# EAGLE design fatina (EAGLE 7.5.0)
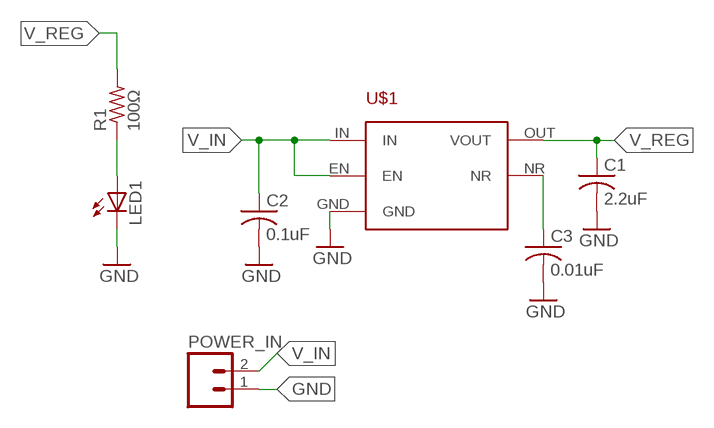
[diagram p0: schematic, sheet 1]

## Parts
C1  2.2uF  C-USC0603  [C0603]
C2  0.1uF  C-USC0603  [C0603]
C3  0.01uF  C-USC0603  [C0603]
LED1  LED5MM  [LED5MM]
POWER_IN  M02PTH  [1X02]
R1  100Ω  R-US_0204/7  [0204/7]
U$1  TPS799  [TPS799]

## Nets
GND: C1.2 C2.2 C3.2 LED1.K(C) POWER_IN.1 U$1.GND
N$1: LED1.A R1.1
N$2: C3.1 U$1.NR
V_IN: C2.1 POWER_IN.2 U$1.EN U$1.IN
V_REG: C1.1 R1.2 U$1.OUT(VOUT)

## Library data of the parts
C1-C3 = rcl:C-US: CAPACITOR, American symbol
LED1 = led:LED: LED OSRAM: - CHIPLED LG R971, LG N971, LY N971, LG Q971, LY Q971, LO R971, LY R971 LH N974, LH R974 LS Q976, LO Q976, LY Q976 LO Q996 - Hyper CHIPLED LW Q18S LB Q993, LB Q99A, LB R99A - SideLED LS A670, LO A670, LY A670, LG A670, LP A670 LB A673, LV A673, LT A673, LW A673 LH A674 LY A675 LS A676, LA A676, LO A676, LY A676, LW A676 LS A679, LY A679, LG A679 - Hyper Micro SIDELED® LS Y876, LA Y876, LO Y876, LY Y876 LT Y87S - SmartLED LW L88C, LW L88S LB L89C, LB L89S, LG L890 LS L89K, LO L89K, LY L89K LS L896, LA L896, LO L896, LY L896 - TOPLED LS T670, LO T670, LY T670, LG T670, LP T670 LSG T670, LSP T670, LSY T670, LOP T670, LYG T670 LG T671, LOG T671, LSG T671 LB T673, LV T673, LT T673, LW T673 LH T674 LS T676, LA T676, LO T676, LY T676, LB T676, LH T676, LSB T676, LW T676 LB T67C, LV T67C, LT T67C, LS T67K, LO T67K, LY T67K, LW E67C LS E67B, LA E67B, LO E67B, LY E67B, LB E67C, LV E67C, LT E67C LW T67C LS T679, LY T679, LG T679 LS T770, LO T770, LY T770, LG T770, LP T770 LB T773, LV T773, LT T773, LW T773 LH T774 LS E675, LA E675, LY E675, LS T675 LS T776, LA T776, LO T776, LY T776, LB T776 LHGB T686 LT T68C, LB T68C - Hyper Mini TOPLED® LB M676 - Mini TOPLED Santana® LG M470 LS M47K, LO M47K, LY M47K Source: http://www.osram.convergy.de LUXEON: - LUMILED® LXK2-PW12-R00, LXK2-PW12-S00, LXK2-PW14-U00, LXK2-PW14-V00 LXK2-PM12-R00, LXK2-PM12-S00, LXK2-PM14-U00 LXK2-PE12-Q00, LXK2-PE12-R00, LXK2-PE12-S00, LXK2-PE14-T00, LXK2-PE14-U00 LXK2-PB12-K00, LXK2-PB12-L00, LXK2-PB12-M00, LXK2-PB14-N00, LXK2-PB14-P00, LXK2-PB14-Q00 LXK2-PR12-L00, LXK2-PR12-M00, LXK2-PR14-Q00, LXK2-PR14-R00 LXK2-PD12-Q00, LXK2-PD12-R00, LXK2-PD12-S00 LXK2-PH12-R00, LXK2-PH12-S00 LXK2-PL12-P00, LXK2-PL12-Q00, LXK2-PL12-R00 Source: www.luxeon.com KINGBRIGHT: KA-3528ASYC Source: www.kingbright.com
POWER_IN = SparkFun1:M02: Header 2 Standard 2-pin 0.1" header. Use with straight break away headers (SKU : PRT-00116), right angle break away headers (PRT-00553), swiss pins (PRT-00743), machine pins (PRT-00117), and female headers (PRT-00115). Molex polarized connector foot print use with SKU : PRT-08233 with associated crimp pins and housings.
R1 = rcl:R-US_: RESISTOR, American symbol
U$1 = 445eagle_assignment:TPS799

## Board
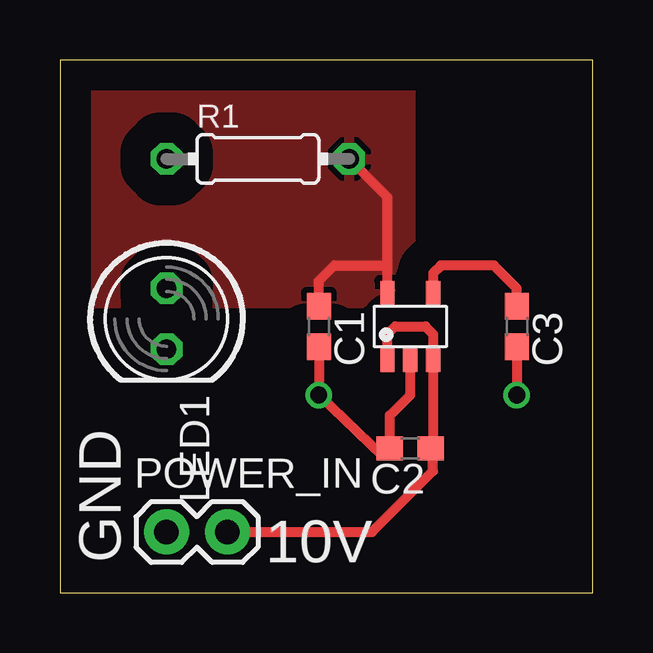
[diagram p1: board, top side]
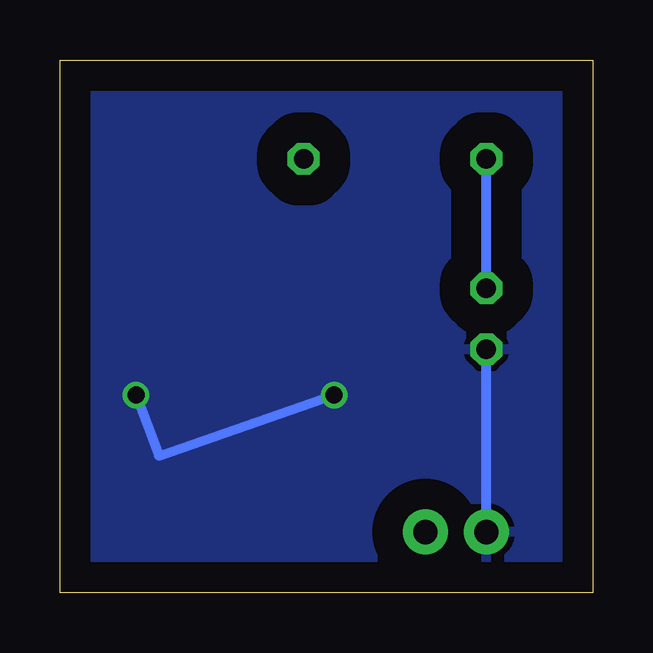
[diagram p2: board, bottom side, seen from below]

Size 22.23 x 22.23 mm. Coordinates in mm from the lower left corner, seen from the top.
Outline: 0,0 22.23,0 22.23,22.23 0,22.23 0,0
Copper layers (1*16): Top 0.035mm / dielectric 1.5mm / Bottom 0.035mm
Design rules "default *": minimum track width 10mil, minimum drill 24mil, track to track 10mil, track to pad 10mil, pad to pad 10mil, via to via 10mil, smd to smd 8mil, copper to edge 40mil, drill to drill 8mil, minimum pad ring 10mil, minimum via ring 8mil, stop-mask expansion 4mil, vias tented up to drill 0mil, thermal gap 10mil

### Footprints (pad centres in the part's own frame; a part is rotated, then mirrored left to right if it is on the bottom)
C0603 = smd 1.1 x 1: 1 -0.85,0; 2 0.85,0
LED5MM = drill 0.813 octagon: A -1.27,0; K 1.27,0
1X02 = drill 1.016 pad 1.88: 1 0,0; 2 2.54,0
0204/7 = drill 0.813 octagon: 1 -3.81,0; 2 3.81,0
TPS799 = smd 1.1 x 0.6: EN -1.35,-0.95; GND -1.35,0; IN -1.35,0.95; NR 1.35,-0.95; OUT 1.35,0.95

### Placement (x,y rotation side)
C1  10.79,11.11 270 top
C2  14.61,6.03 180 top
C3  19.05,11.11 270 top
LED1  4.45,11.43 270 top
POWER_IN  4.45,2.54 0 top
R1  8.26,18.1 0 top
U$1  14.61,11.11 90 top

### Tracks (layer width: path | path; a pad name or v marks a point on that pad's centre or on a via)
GND  (via drill 0.7)
  Top 0.406: U$1.GND 14.61,8.26 13.76,7.41 C2.2 13.44,5.71 v10.79,8.26 C1.2 | C3.2 v19.05,8.26
  Bottom 0.406: POWER_IN.1 LED1.K | v19.05,8.26 18.1,5.71 v10.79,8.26
  pour Bottom (isolate 1.27): 0.64,21.59 21.59,21.59 21.59,0.64 0.64,0.64
N$1
  Bottom 0.406: LED1.A R1.1
N$2
  Top 0.406: C3.1 19.05,12.7 18.1,13.65 15.88,13.65 15.56,13.34 U$1.NR
V_IN
  Top 0.406: U$1.IN 13.65,10.8 13.97,11.11 15.24,11.11 15.56,10.79 U$1.EN 15.55,6.13 C2.1 15.56,5.93 15.56,5.08 13.02,2.54 POWER_IN.2
V_REG
  Top 0.406: U$1.OUT 13.65,13.65 | 13.65,13.65 13.65,16.51 R1.2 | C1.1 10.79,13.02 11.43,13.65 13.65,13.65
  pour Top (isolate 1.27): 1.27,20.95 14.61,20.95 14.61,12.06 1.27,12.06

### Text on the board
tNames: GND | 10V